# Altium schematic sheet MCU.SchDoc
size A4
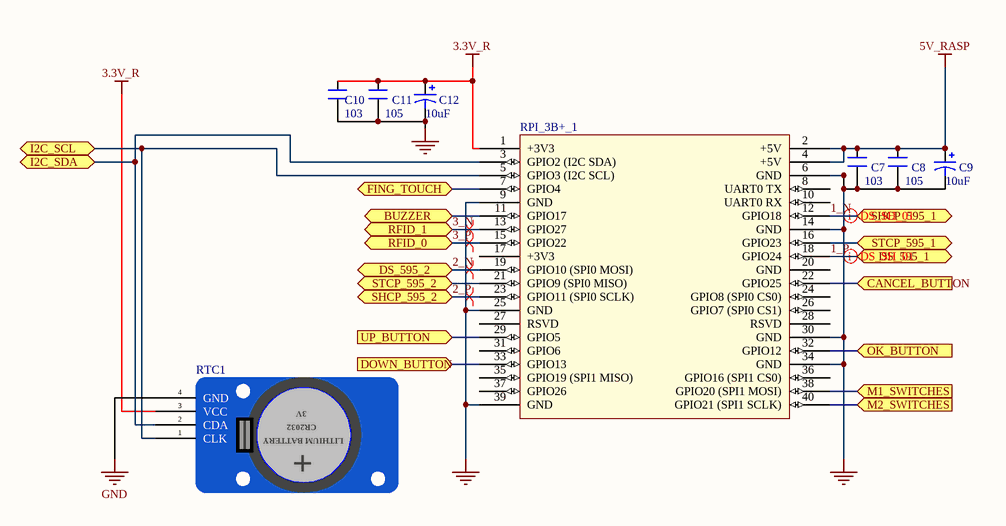
[diagram p0: MCU.SchDoc]

## Parts
C7  103  [CN1]
C8  105  [CN1]
C9  10uF  [CP2/5]
C10  103  [CN1]
C11  105  [CN1]
C12  10uF  [CP2/5]
RPI_3B+_1  RPI GPIO Connector  [RPI-holes]  (value not drawn)
RTC1  6#RTC_DS3231_4Pin  [6#RTC_DS3231_4Pin]  (value not drawn)

## Ports
BUZZER (bidir), CANCEL_BUTTON (in), DOWN_BUTTON (in), DS_595_1 (bidir), DS_595_2 (bidir), FING_TOUCH (bidir), I2C_SCL (bidir), I2C_SDA (bidir), M1_SWITCHES (in), M2_SWITCHES (in), OK_BUTTON (in), RFID_0 (bidir), RFID_1 (bidir), SHCP_595_1 (bidir), SHCP_595_2 (bidir), STCP_595_1 (bidir), STCP_595_2 (bidir), UP_BUTTON (in)

## Nets
3.3V_R: C10.2 C11.2 C12.1 RPI_3B+_1.1(+3V3) RTC1.3(VCC)
5V_RASP: C7.2 C8.2 C9.1 RPI_3B+_1.2(+5V) RPI_3B+_1.4(+5V)
GND: C7.1 C8.1 C9.2 C10.1 C11.1 C12.2 RPI_3B+_1.6(GND) RPI_3B+_1.9(GND) RPI_3B+_1.14(GND) RPI_3B+_1.25(GND) RPI_3B+_1.30(GND) RPI_3B+_1.34(GND) RPI_3B+_1.39(GND) RTC1.4(GND)
1_N: RPI_3B+_1.12(GPIO18) ; port SHCP_595_1
1_P: RPI_3B+_1.18(GPIO24) ; port DS_595_1
2_N: RPI_3B+_1.19(GPIO10_(SPI0_MOSI)) ; port DS_595_2
2_P: RPI_3B+_1.23(GPIO11_(SPI0_SCLK)) ; port SHCP_595_2
3_N: RPI_3B+_1.13(GPIO27) ; port RFID_1
3_P: RPI_3B+_1.15(GPIO22) ; port RFID_0
BUZZER: RPI_3B+_1.11(GPIO17) ; port BUZZER
CANCEL_BUTTON: RPI_3B+_1.22(GPIO25) ; port CANCEL_BUTTON
DOWN_BUTTON: RPI_3B+_1.33(GPIO13) ; port DOWN_BUTTON
FING_TOUCH: RPI_3B+_1.7(GPIO4) ; port FING_TOUCH
I2C_SCL: RPI_3B+_1.5(GPIO3_(I2C_SCL)) RTC1.1(CLK) ; port I2C_SCL
I2C_SDA: RPI_3B+_1.3(GPIO2_(I2C_SDA)) RTC1.2(CDA) ; port I2C_SDA
M1_SWITCHES: RPI_3B+_1.38(GPIO20_(SPI1_MOSI)) ; port M1_SWITCHES
M2_SWITCHES: RPI_3B+_1.40(GPIO21_(SPI1_SCLK)) ; port M2_SWITCHES
OK_BUTTON: RPI_3B+_1.32(GPIO12) ; port OK_BUTTON
STCP_595_1: RPI_3B+_1.16(GPIO23) ; port STCP_595_1
STCP_595_2: RPI_3B+_1.21(GPIO9_(SPI0_MISO)) ; port STCP_595_2
UP_BUTTON: RPI_3B+_1.29(GPIO5) ; port UP_BUTTON

Not connected (* = marked no-connect by the designer): RPI_3B+_1 8(UART0_TX) 10(UART0_RX) 17(+3V3) 20(GND) 24(GPIO8_(SPI0_CS0)) 26(GPIO7_(SPI0_CS1)) 27(RSVD) 28(RSVD) 31(GPIO6) 35(GPIO19_(SPI1_MISO)) 36(GPIO16_(SPI1_CS0)) 37(GPIO26)

## Layout directives
differential pair: 1_N, 1_P, 2_N, 2_P, 3_N, 3_P

## Notes on the sheet
- (in symbol 6#RTC_DS3231_4Pin) 3V; CR2032; +; LITHIUM BATTERY

## Library data of the parts
C7 C8 C10 C11 = CN1: Cap np  1pF - 472pF; Value: 100pF
C9 C12 = Cap Pol3_1: Polarized Capacitor (Surface Mount); Name: C9; LatestRevisionDate: 17-Jul-2002; LatestRevisionNote: Re-released for DXP Platform.; PackageReference: C0805; Publisher: Altium Limited; Value: 10uF
RPI_3B+_1 = rpi connector_2holes: GPIO Header for Raspberry Pi A+/B+/Pi 2/Pi 3 - 2x20; Manufacturer: SparkFun Electronics; Manufacturer Part Number: PRT-14017; Nils Minor: author; nilsminor@web.de: mail; RoHS: RoHS Compliant; Category: Development Boards, Kits, Programmers; Stock 1: 150; Pricing 1: 1=1.84 (EUR); Part Status: Active; Accessory Type: Connector; For Use With/Related Products: Raspberry Pi; ComponentLink1URL: https://cdn.sparkfun.com/datasheets/Dev/RaspberryPi/12313.pdf; ComponentLink1Description: https://cdn.sparkfun.com/datasheets/Dev/RaspberryPi/12313.pdf; Supplier 1: Digi-Key; Supplier Part Number 1: 1568-1462-ND